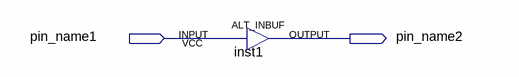
[diagram p0: schematic sheet]
// Quartus schematic teste_buffer.bdf as structural Verilog: 1 symbols, 2 pins
module teste_buffer (
  input  pin_name1,
  output pin_name2
);

  ALT_INBUF inst1 (.i(pin_name1), .o(pin_name2));
endmodule
